# Altium schematic sheet CtDSP_IO.SchDoc
size 431 x 279 mm; SheetNumber: 1; SheetTotal: 2; ENG_APP_DATE: --/--/--; DSN_APP_DATE: --/--/--; CHK_APP_DATE: --/--/--
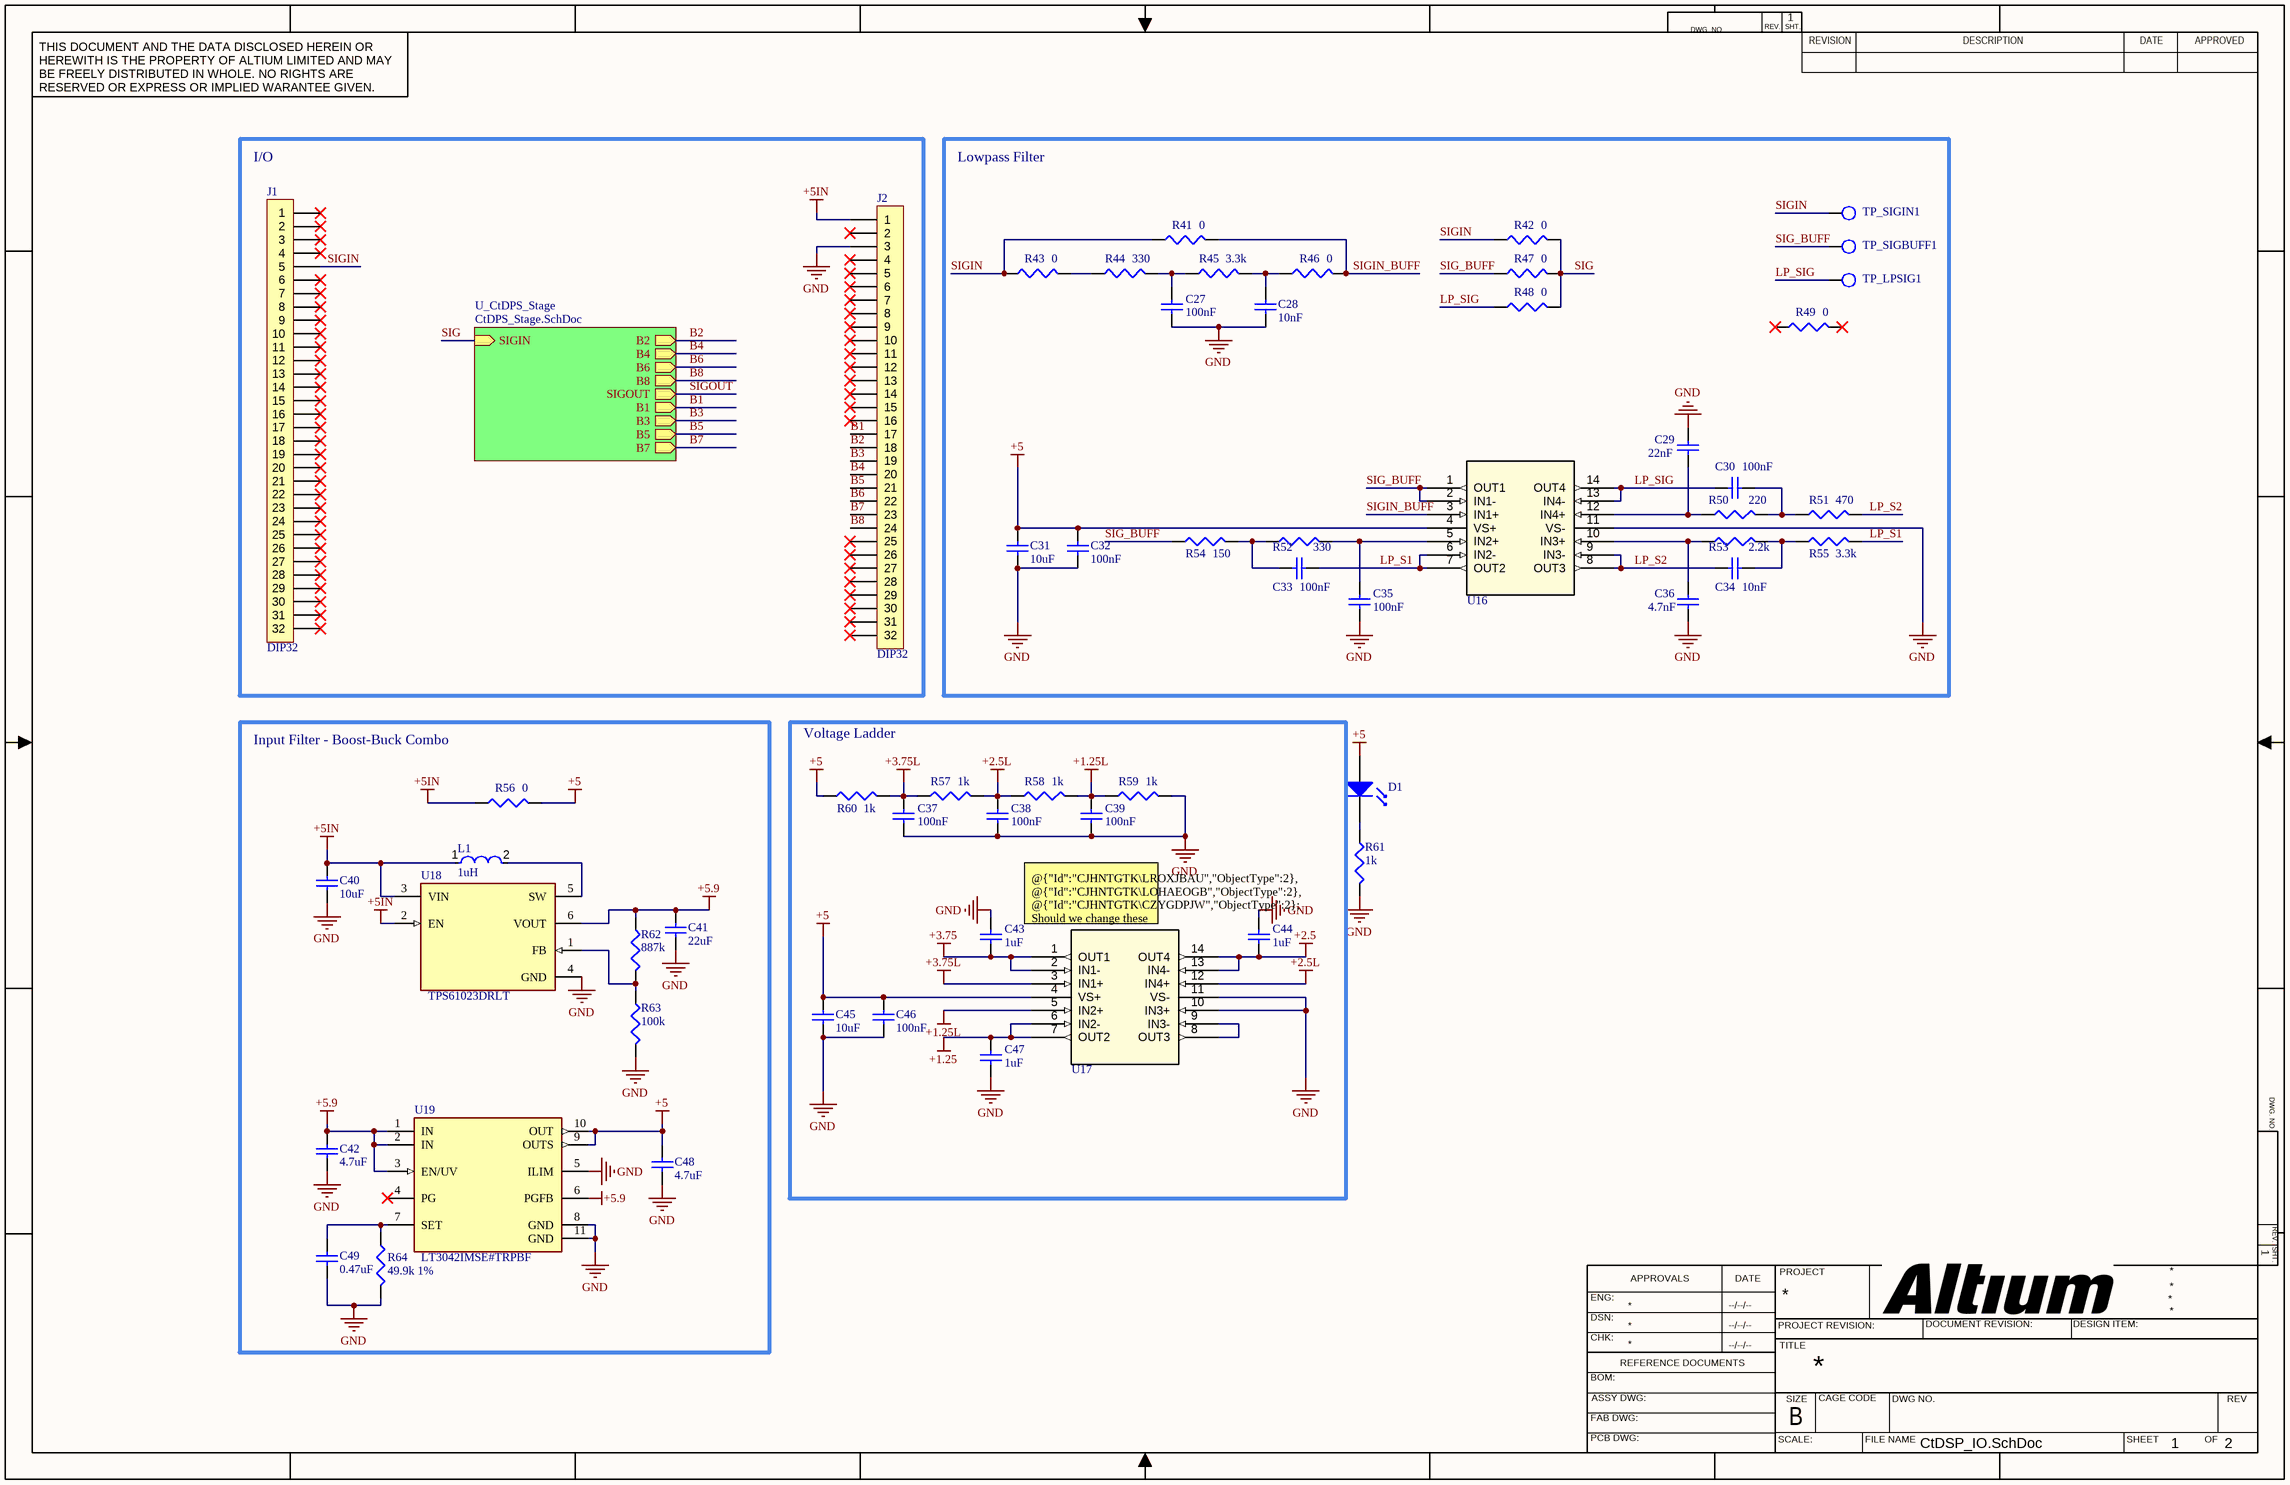
[diagram p0: CtDSP_IO.SchDoc]

## Parts
C27  100nF  [C_0402]
C28  10nF  [C_0402]
C29  22nF  [C_0402]
C30  100nF  [C_0402]
C31  10uF  [C_0402]
C32  100nF  [C_0402]
C33  100nF  [C_0402]
C34  10nF  [C_0402]
C35  100nF  [C_0402]
C36  4.7nF  [C_0402]
C37  100nF  [C_0402]
C38  100nF  [C_0402]
C39  100nF  [C_0402]
C40  10uF  [C_0402]
C41  22uF  [C_0603]
C42  4.7uF  [C_0603]
C43  1uF  [C_0603]
C44  1uF  [C_0603]
C45  10uF  [C_0402]
C46  100nF  [C_0402]
C47  1uF  [C_0603]
C48  4.7uF  [C_0603]
C49  0.47uF  [C_0603]
D1  LED_0603  [LED_6003]  (value not drawn)
J1  DIP32  [DIP32]
J2  DIP32  [DIP32]
L1  1uH  [FP-MLP1005D-IPC_C]
R41  0  [RES_1206]
R42  0  [RES_1206]
R43  0  [RES_1206]
R44  330  [RES_0603]
R45  3.3k  [RES_0603]
R46  0  [RES_1206]
R47  0  [RES_1206]
R48  0  [RES_1206]
R49  0  [RES_1206]
R50  220  [RES_0402]
R51  470  [RES_0402]
R52  330  [RES_0603]
R53  2.2k  [RES_0603]
R54  150  [RES_0603]
R55  3.3k  [RES_0603]
R56  0  [RES_1206]
R57  1k  [RES_0603]
R58  1k  [RES_0603]
R59  1k  [RES_0603]
R60  1k  [RES_0603]
R61  1k  [RES_0402]
R62  887k  [RES_0402]
R63  100k  [RES_0402]
R64  49.9k 1%  [RES_0603]
TP_LPSIG1  TESTPOINT  [TESTPOINT]  (value not drawn)
TP_SIGBUFF1  TESTPOINT  [TESTPOINT]  (value not drawn)
TP_SIGIN1  TESTPOINT  [TESTPOINT]  (value not drawn)
U16  ADA4891-4ARZ-R7  [ADA4891-4ARZ-R7]  (value not drawn)
U17  ADA4891-4ARZ-R7  [ADA4891-4ARZ-R7]  (value not drawn)
U18  TPS61023DRLT  [FP-DRL0006A-MFG]
U19  LT3042IMSE#TRPBF  [FP-MSE-10-05-08-1664-IPC_A]

## Blocks framed on the sheet
I/O: J1 J2
Lowpass Filter: C27-C36 R41-R55 TP_LPSIG1 TP_SIGBUFF1 TP_SIGIN1 U16
Input Filter - Boost-Buck Combo: C40-C42 C48 C49 L1 R56 R62-R64 U18 U19
Voltage Ladder: C37-C39 C43-C47 R57-R60 U17

## Sub-sheets
U_CtDPS_Stage = CtDPS_Stage.SchDoc: B2 (out), B4 (out), B6 (out), B8 (out), SIGIN (in), SIGOUT (out), B1 (out), B3 (out), B5 (out), B7 (out)

## Nets
+1.25: C47.2 U17.6(IN2-) U17.7(OUT2)
+1.25L: C39.2 R58.2 R59.1 U17.5(IN2+)
+2.5: C44.1 U17.13(IN4-) U17.14(OUT4)
+2.5L: C38.2 R57.2 R58.1 U17.12(IN4+)
+3.75: C43.1 U17.1(OUT1) U17.2(IN1-)
+3.75L: C37.2 R57.1 R60.2 U17.3(IN1+)
+5: C31.1 C32.2 C45.1 C46.2 C48.2 D1.2(K) R56.2 R60.1 U16.4(VS+) U17.4(VS+) U19.9(OUTS) U19.10(OUT)
+5.9: C41.2 C42.2 R62.1 U18.6(VOUT) U19.1(IN) U19.2(IN) U19.3(EN/UV) U19.6(PGFB)
+5IN: C40.2 J2.1 L1.1 R56.1 U18.2(EN) U18.3(VIN)
GND: C27.1 C28.1 C29.2 C31.2 C32.1 C35.1 C36.1 C37.1 C38.1 C39.1 C40.1 C41.1 C42.1 C43.2 C44.2 C45.2 C46.1 C47.1 C48.1 C49.1 J2.3 R59.2 R61.2 R63.2 R64.2 U16.11(VS-) U17.10(IN3+) U17.11(VS-) U18.4(GND) U19.5(ILIM) U19.8(GND) U19.11(GND)
B1: J2.17 ; sheet U_CtDPS_Stage/B1
B2: J2.18 ; sheet U_CtDPS_Stage/B2
B3: J2.19 ; sheet U_CtDPS_Stage/B3
B4: J2.20 ; sheet U_CtDPS_Stage/B4
B5: J2.21 ; sheet U_CtDPS_Stage/B5
B6: J2.22 ; sheet U_CtDPS_Stage/B6
B7: J2.23 ; sheet U_CtDPS_Stage/B7
B8: J2.24 ; sheet U_CtDPS_Stage/B8
LP_S1: C33.1 R55.2 U16.6(IN2-) U16.7(OUT2)
LP_S2: C34.1 R51.2 U16.8(OUT3) U16.9(IN3-)
LP_SIG: C30.2 R48.1 TP_LPSIG1.1 U16.13(IN4-) U16.14(OUT4)
SIG: R42.2 R47.2 R48.2 ; sheet U_CtDPS_Stage/SIGIN
SIG_BUFF: R47.1 R54.1 TP_SIGBUFF1.1 U16.1(OUT1) U16.2(IN1-)
SIGIN: J1.5 R41.1 R42.1 R43.1 TP_SIGIN1.1
SIGIN_BUFF: R41.2 R46.2 U16.3(IN1+)
SIGOUT: sheet U_CtDPS_Stage/SIGOUT
NetC27_2: C27.2 R44.2 R45.1
NetC28_2: C28.2 R45.2 R46.1
NetC29_1: C29.1 R50.1 U16.12(IN4+)
NetC30_1: C30.1 R50.2 R51.1
NetC33_2: C33.2 R52.1 R54.2
NetC34_2: C34.2 R53.2 R55.1
NetC35_2: C35.2 R52.2 U16.5(IN2+)
NetC36_2: C36.2 R53.1 U16.10(IN3+)
NetC49_2: C49.2 R64.1 U19.7(SET)
NetD1_1: D1.1(A) R61.1
NetL1_2: L1.2 U18.5(SW)
NetR43_2: R43.2 R44.1
NetR62_2: R62.2 R63.1 U18.1(FB)
NetU17_8: U17.8(OUT3) U17.9(IN3-)

Not connected (* = marked no-connect by the designer): J1 1* 2* 3* 4* 6* 7* 8* 9* 10* 11* 12* 13* 14* 15* 16* 17* 18* 19* 20* 21* 22* 23* 24* 25* 26* 27* 28* 29* 30* 31* 32*; J2 2* 4* 5* 6* 7* 8* 9* 10* 11* 12* 13* 14* 15* 16* 25* 26* 27* 28* 29* 30* 31* 32*; R49 1* 2*; U19 4(PG)*

## Notes on the sheet
- @{"Id":"CJHNTGTK\LROXJBAU","ObjectType":2}, @{"Id":"CJHNTGTK\LOHAEOGB","ObjectType":2}, @{"Id":"CJHNTGTK\CZYGDPJW","ObjectType":2}; Should we change these bulk cap values?
- DWG. NO.
- REV.
- SHT.
- THIS DOCUMENT AND THE DATA DISCLOSED HEREIN OR HEREWITH IS THE PROPERTY OF ALTIUM LIMITED AND MAY BE FREELY DISTRIBUTED IN WHOLE. NO RIGHTS ARE RESERVED OR EXPRESS OR IMPLIED WARANTEE GIVEN.
- REVISION
- DESCRIPTION
- DATE
- APPROVED
- ENG:
- APPROVALS
- PROJECT
- DSN:
- CHK:
- REFERENCE DOCUMENTS
- PROJECT REVISION:
- TITLE
- DOCUMENT REVISION:
- DESIGN ITEM:
- BOM:
- FAB DWG:
- PCB DWG:
- ASSY DWG:
- SCALE:
- SIZE
- B
- CAGE CODE
- FILE NAME
- DWG NO.
- SHEET
- OF
- REV

## Library data of the parts
C27-C42 C45 C46 C48 C49 = C_0402
  C27 C30 C32 C33 C35 C37-C39 C46: LCSC Part #: C1525
  C28 C34: LCSC Part #: C15195
  C29: LCSC Part #: C1532
  C31 C40 C45: LCSC Part #: C15525
  C36: LCSC Part #: C1538
  C41: LCSC Part #: C59461
  C42 C48: LCSC Part #: C19666
  C49: LCSC Part #: C1623
C43 C44 C47 = C_0603: LCSC Part #: C15849
L1 = CMP-08253-000043-1: FIXED IND 1UH 500MA 689 MOHM SMD; Test Frequency: 10MHz; Shielding: Shielded; DC Resistance (DCR): 689mR; Tolerance: 20%; Core Material: Ferrite; Case/Package: 0402; Packaging: Tape and Reel; Height - Seated (Max): 0.03inch; Termination: SMD/SMT; Weight: 2.3E-05oz; Mount: Surface Mount; Height: 0.75mm; RoHS Compliant: Yes; Max DC Current: 500mA; Case Code (Metric): 1005; Width: 0.02inch; Current Rating: 500mA; Length: 0.039inch; Package Quantity: 8000; Case Code (Imperial): 0402; Max Operating Temperature: 125°C; Min Operating Temperature: -40°C; Inductance: 1uH; LCSC Part #: C531284
R41-R43 R46-R49 R56 = RES_1206: LCSC Part #: C17888
R44 R45 R52-R55 R57-R60 = RES_0603
  R44 R52: LCSC Part #: C23138
  R45 R55: LCSC Part #: C22978
  R53: LCSC Part #: C4190
  R54: LCSC Part #: C22808
  R57-R60: LCSC Part #: C5123612
R50 R51 R61-R64 = RES_0402
  R50: LCSC Part #: C25091
  R51: LCSC Part #: C25117
  R61: LCSC Part #: C11702
  R62: LCSC Part #: C11547
  R63: LCSC Part #: C25741
  R64: LCSC Part #: C23184
U16 U17 = ADA4891-4ARZ-R7: Quad Rail-to-Rail Op-Amp, 240 MHz, 170 V/µs, SOT-23-5; LCSC Part #: C654290
U18 = CMP-04918-000657-1: IC REG BOOST ADJ 3A SOT563; LCSC Part #: C1852149
U19 = CMP-09138-000225-1: IC REG LIN POS ADJ 200MA 10MSOP; Number of Regulators: 1; Min Current Limit: 220mA; Output Voltage: 15V; Dropout Voltage: 350mV; Series: -; RoHS Compliant: Yes; Case/Package: MSOP; Min Operating Temperature: -40°C; Packaging: Tape and Reel; Max Operating Temperature: 125°C; Number of Pins: 10; Output Current: 200mA; Mount: Surface Mount; LCSC Part #: C666569
D1 = LED_0603: LCSC Part #: C2286